# Altium schematic sheet cm4-carrier-net.SchDoc
size 594 x 420 mm
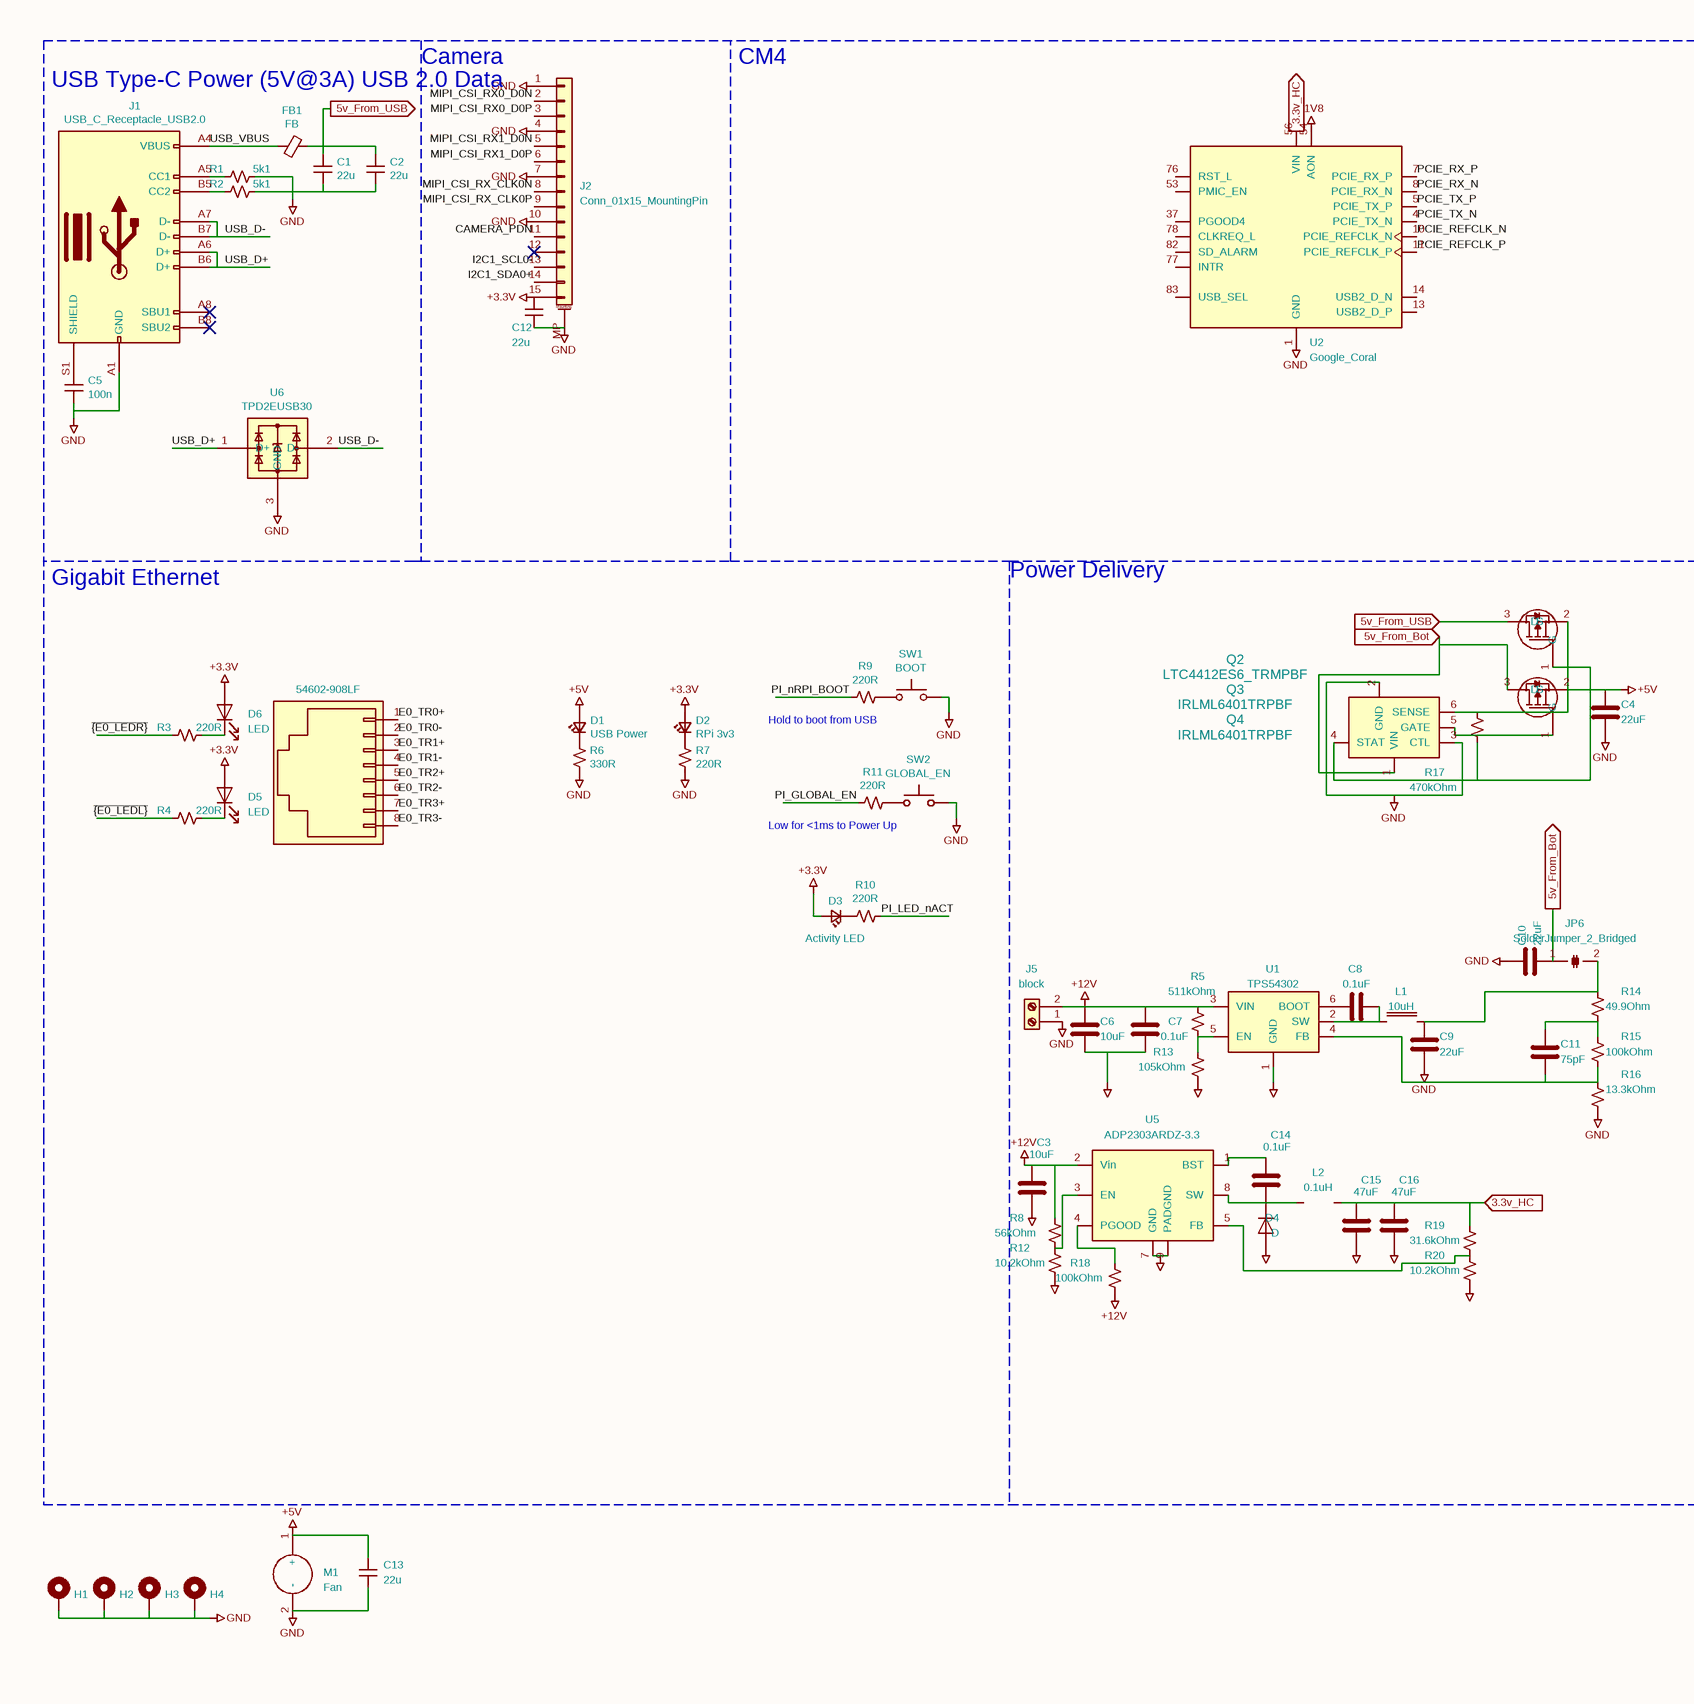
[diagram p0: cm4-carrier-net.SchDoc, left]
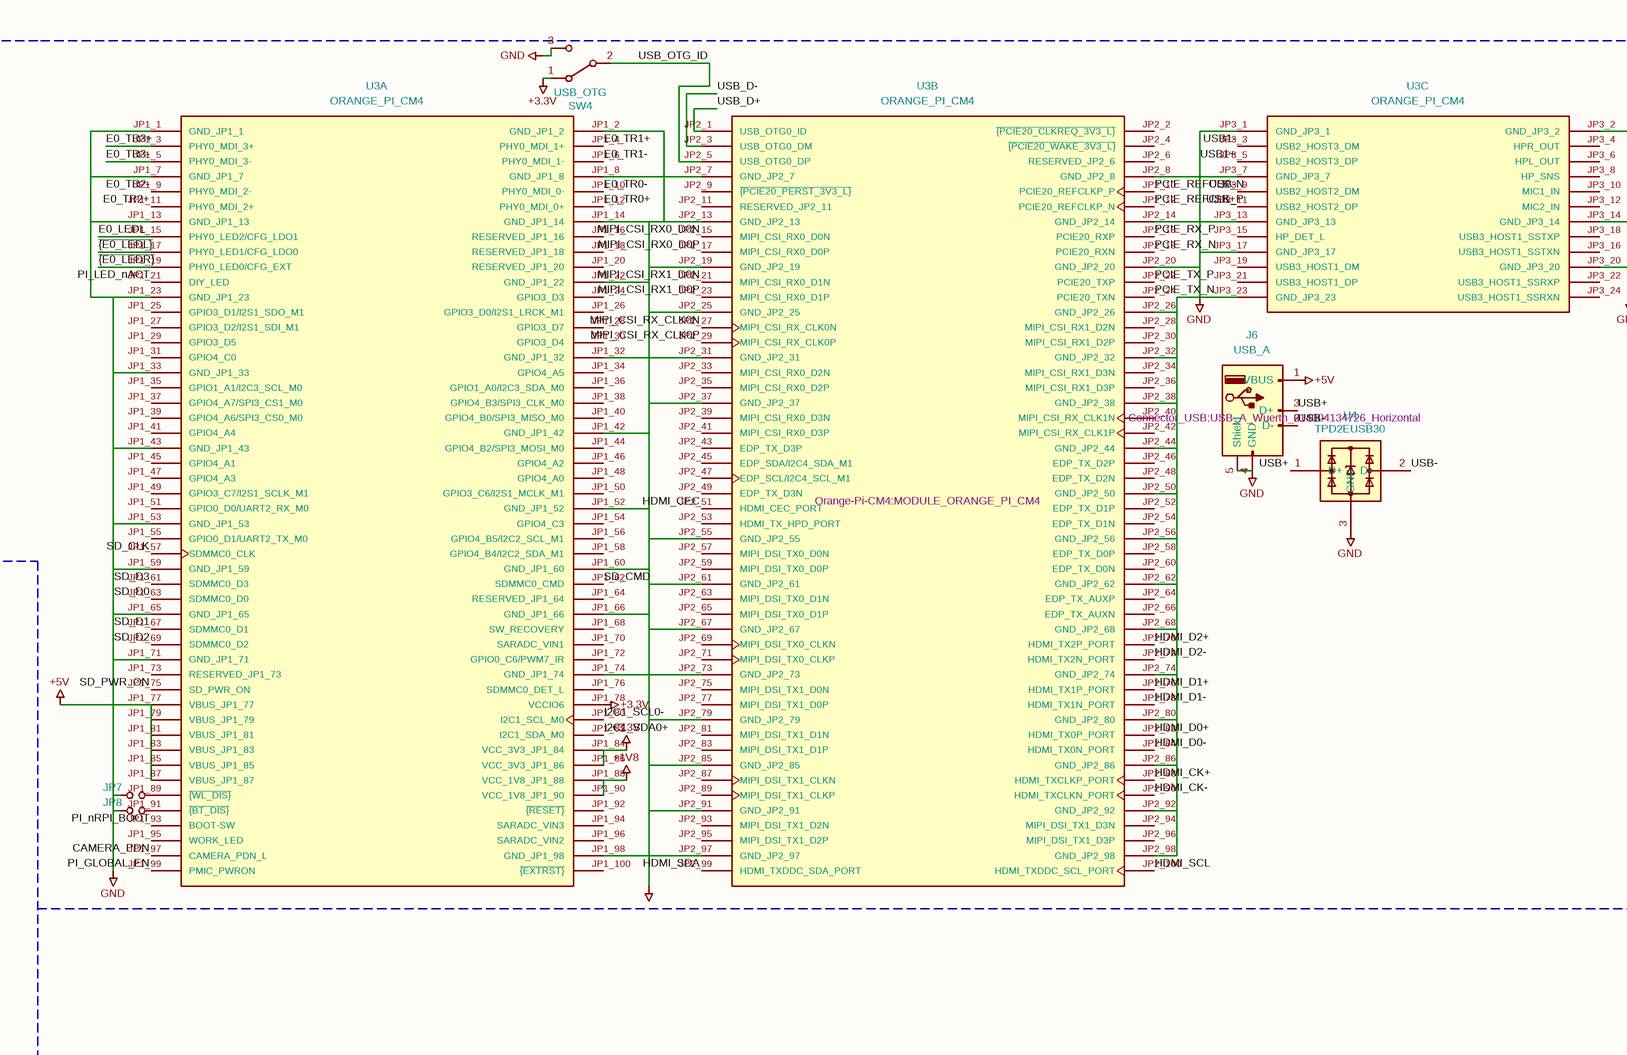
[diagram p1: cm4-carrier-net.SchDoc, middle]
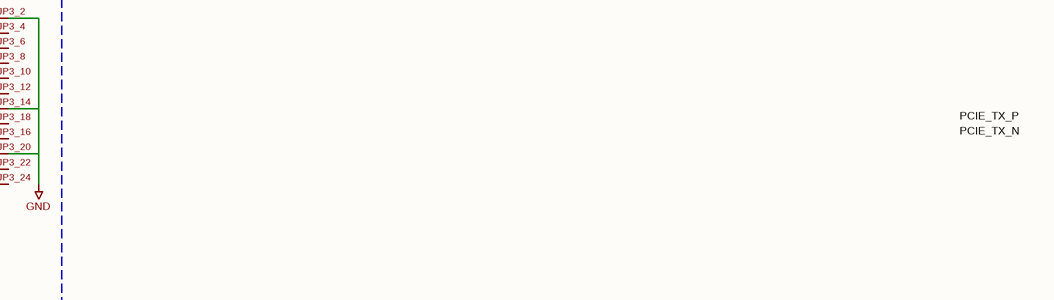
[diagram p2: cm4-carrier-net.SchDoc, right]

## Parts
C1  22u  [C_0805_2012Metric]
C2  22u  [C_0805_2012Metric]
C3  10uF  [C_1206_3216Metric]
C4  22uF  [C_1206_3216Metric]
C5  100n  [C_0805_2012Metric]
C6  10uF  [C_1206_3216Metric]
C7  0.1uF  [C_1206_3216Metric]
C8  0.1uF  [C_1206_3216Metric]
C9  22uF  [C_1206_3216Metric]
C10  22uF  [C_1206_3216Metric]
C11  75pF  [C_1206_3216Metric]
C12  22u  [C_0805_2012Metric]
C13  22u  [C_0805_2012Metric]
C14  0.1uF  [C_1206_3216Metric]
C15  47uF  [C_1206_3216Metric]
C16  47uF  [C_1206_3216Metric]
D1  USB Power  [LED_0603_1608Metric]
D2  RPi 3v3  [LED_0603_1608Metric]
D3  Activity LED  [LED_0603_1608Metric]
D4  D  [D_1206_3216Metric]
D5  LED  [D_1206_3216Metric_Pad1.42x1.75mm_HandSolder]
D6  LED  [D_1206_3216Metric_Pad1.42x1.75mm_HandSolder]
FB1  FB  [L_0805_2012Metric]
H1  MountingHole_Pad  [MountingHole_2.7mm_M2.5_Pad_Via]  (value not drawn)
H2  MountingHole_Pad  [MountingHole_2.7mm_M2.5_Pad_Via]  (value not drawn)
H3  MountingHole_Pad  [MountingHole_2.7mm_M2.5_Pad_Via]  (value not drawn)
H4  MountingHole_Pad  [MountingHole_2.7mm_M2.5_Pad_Via]  (value not drawn)
J1  USB_C_Receptacle_USB2.0  [USB_C_Receptacle_G-Switch_GT-USB-7010ASV]
J2  Conn_01x15_MountingPin  [Molex_200528-0150_1x15-1MP_P1.00mm_Horizontal]
J3  54602-908LF  [Ethernet_Jack_54602-908LF]
J5  block  [TerminalBlock_4Ucon_1x02_P3.50mm_Vertical]
J6  Footprint: Connector_USB:USB_A_Wuerth_614004134726_Horizontal  [USB_A_Wuerth_614004134726_Horizontal]  (hidden comment: USB_A)
JP6  SolderJumper_2_Bridged  [SolderJumper-2_P1.3mm_Bridged2Bar_RoundedPad1.0x1.5mm]
JP7  ~WL_nDisable  [SolderJumper-2_P1.3mm_Bridged2Bar_Pad1.0x1.5mm]  (value not drawn)
JP8  ~BT_nDisable  [SolderJumper-2_P1.3mm_Bridged2Bar_Pad1.0x1.5mm]  (value not drawn)
L1  10uH  [L_6.3x6.3_H3]
L2  0.1uH  [L_6.3x6.3_H3]
M1  Fan  [PinHeader_1x02_P2.54mm_Vertical]
Q2  LTC4412ES6_TRMPBF  [SOT-23-6]
Q3  IRLML6401TRPBF  [SOT-23-3]
Q4  IRLML6401TRPBF  [SOT-23-3]
R1  5k1  [R_0603_1608Metric]
R2  5k1  [R_0603_1608Metric]
R3  220R  [R_0603_1608Metric]
R4  220R  [R_0603_1608Metric]
R5  511kOhm  [R_0603_1608Metric]
R6  330R  [R_0603_1608Metric]
R7  220R  [R_0603_1608Metric]
R8  56kOhm  [R_0603_1608Metric]
R9  220R  [R_0603_1608Metric]
R10  220R  [R_0603_1608Metric]
R11  220R  [R_0603_1608Metric]
R12  10.2kOhm  [R_0603_1608Metric]
R13  105kOhm  [R_0603_1608Metric]
R14  49.9Ohm  [R_0603_1608Metric]
R15  100kOhm  [R_0603_1608Metric]
R16  13.3kOhm  [R_0603_1608Metric]
R17  470kOhm  [R_0603_1608Metric]
R18  100kOhm  [R_0603_1608Metric]
R19  31.6kOhm  [R_0603_1608Metric]
R20  10.2kOhm  [R_0603_1608Metric]
SW1  BOOT  [SW_SPST_B3U-1000P]
SW2  GLOBAL_EN  [SW_SPST_B3U-1000P]
SW4  USB_OTG  [SW_SPDT_CK-JS102011SAQN]
U1  TPS54302  [SOT-23-6]
U2  Google_Coral  [Google_Coral_SMT_TPU_Module]
U3  ORANGE_PI_CM4  [MODULE_ORANGE_PI_CM4]  (parts A,B,C of 3)
U4  TPD2EUSB30  [Texas_DRT-3]
U5  ADP2303ARDZ-3.3  [SOIC-8-1EP_3.9x4.9mm_P1.27mm_EP2.29x3mm]
U6  TPD2EUSB30  [Texas_DRT-3]

## Ports
3.3v_HC (in), 5v_From_Bot (in), 5v_From_Bot (out), 5v_From_USB (in), 5v_From_USB (out)

## Nets
+1V8: U2.54(AON) U3.JP1_88(VCC_1V8_JP1_88) U3.JP1_90(VCC_1V8_JP1_90)
+3.3V: C12.1 D2.2(A) D3.2(A) D5.2(A) D6.2(A) J2.15(Pin_15) SW4.1(A) U3.JP1_78(VCCIO6) U3.JP1_84(VCC_3V3_JP1_84) U3.JP1_86(VCC_3V3_JP1_86)
+5V: C4.1 C13.1 D1.2(A) J6.1(VBUS) M1.1(+) Q2.6(SENSE) Q3.2(S) Q4.2(S) R17.1 U3.JP1_77(VBUS_JP1_77) U3.JP1_79(VBUS_JP1_79) U3.JP1_81(VBUS_JP1_81) U3.JP1_83(VBUS_JP1_83) U3.JP1_85(VBUS_JP1_85) U3.JP1_87(VBUS_JP1_87)
+12V: C3.1 C6.1 C7.1 J5.2(Pin_2) R5.1 R8.1 R18.2 U1.3(VIN) U5.2(Vin)
GND: C1.2 C2.2 C3.2 C4.2 C5.2 C6.2 C7.2 C9.2 C10.1 C12.2 C13.2 C15.2 C16.2 D4.2(A) H1.1 H2.1 H3.1 H4.1 J1.A1(GND) J2.1(Pin_1) J2.4(Pin_4) J2.7(Pin_7) J2.10(Pin_10) J2.MP(MountPin) J5.1(Pin_1) J6.4(GND) J6.5(Shield) JP7.1 JP8.1 M1.2(-) Q2.2(GND) Q2.3(CTL) R1.1 R2.1 R6.2 R7.2 R12.2 R13.2 R16.2 R20.2 SW1.2 SW2.2 SW4.3(C) U1.1(GND) U2.1(GND) U3.JP1_1(GND_JP1_1) U3.JP1_2(GND_JP1_2) U3.JP1_7(GND_JP1_7) U3.JP1_8(GND_JP1_8) U3.JP1_13(GND_JP1_13) U3.JP1_14(GND_JP1_14) U3.JP1_22(GND_JP1_22) U3.JP1_23(GND_JP1_23) U3.JP1_32(GND_JP1_32) U3.JP1_33(GND_JP1_33) U3.JP1_42(GND_JP1_42) U3.JP1_43(GND_JP1_43) U3.JP1_52(GND_JP1_52) U3.JP1_53(GND_JP1_53) U3.JP1_59(GND_JP1_59) U3.JP1_60(GND_JP1_60) U3.JP1_65(GND_JP1_65) U3.JP1_66(GND_JP1_66) U3.JP1_71(GND_JP1_71) U3.JP1_74(GND_JP1_74) U3.JP1_98(GND_JP1_98) U3.JP2_7(GND_JP2_7) U3.JP2_8(GND_JP2_8) U3.JP2_13(GND_JP2_13) U3.JP2_14(GND_JP2_14) U3.JP2_19(GND_JP2_19) U3.JP2_20(GND_JP2_20) U3.JP2_25(GND_JP2_25) U3.JP2_26(GND_JP2_26) U3.JP2_31(GND_JP2_31) U3.JP2_32(GND_JP2_32) U3.JP2_37(GND_JP2_37) U3.JP2_38(GND_JP2_38) U3.JP2_44(GND_JP2_44) U3.JP2_50(GND_JP2_50) U3.JP2_55(GND_JP2_55) U3.JP2_56(GND_JP2_56) U3.JP2_61(GND_JP2_61) U3.JP2_62(GND_JP2_62) U3.JP2_67(GND_JP2_67) U3.JP2_68(GND_JP2_68) U3.JP2_73(GND_JP2_73) U3.JP2_74(GND_JP2_74) U3.JP2_79(GND_JP2_79) U3.JP2_80(GND_JP2_80) U3.JP2_85(GND_JP2_85) U3.JP2_86(GND_JP2_86) U3.JP2_91(GND_JP2_91) U3.JP2_92(GND_JP2_92) U3.JP2_97(GND_JP2_97) U3.JP2_98(GND_JP2_98) U3.JP3_1(GND_JP3_1) U3.JP3_2(GND_JP3_2) U3.JP3_7(GND_JP3_7) U3.JP3_13(GND_JP3_13) U3.JP3_14(GND_JP3_14) U3.JP3_17(GND_JP3_17) U3.JP3_20(GND_JP3_20) U3.JP3_23(GND_JP3_23) U4.3(GND) U5.7(GND) U5.9(PADGND) U6.3(GND)
3.3v_HC: C15.1 C16.1 L2.2 R19.1 U2.56(VIN) ; port 3.3v_HC
5v_From_Bot: C10.2 JP6.1(A) Q2.1(VIN) Q3.3(D) ; port 5v_From_Bot
5v_From_USB: C1.1 C2.1 FB1.1 Q4.3(D) ; port 5v_From_USB
CAMERA_PDN: J2.11(Pin_11) U3.JP1_97(CAMERA_PDN_L)
E0_LEDL: U3.JP1_15(PHY0_LED2/CFG_LDO1)
E0_TR0+: J3.1 U3.JP1_12(PHY0_MDI_0+)
E0_TR0-: J3.2 U3.JP1_10(PHY0_MDI_0-)
E0_TR1+: J3.3 U3.JP1_4(PHY0_MDI_1+)
E0_TR1-: J3.4 U3.JP1_6(PHY0_MDI_1-)
E0_TR2+: J3.5 U3.JP1_11(PHY0_MDI_2+)
E0_TR2-: J3.6 U3.JP1_9(PHY0_MDI_2-)
E0_TR3+: J3.7 U3.JP1_3(PHY0_MDI_3+)
E0_TR3-: J3.8 U3.JP1_5(PHY0_MDI_3-)
HDMI_CEC: U3.JP2_51(HDMI_CEC_PORT)
HDMI_CK+: U3.JP2_88(HDMI_TXCLKP_PORT)
HDMI_CK-: U3.JP2_90(HDMI_TXCLKN_PORT)
HDMI_D0+: U3.JP2_82(HDMI_TX0P_PORT)
HDMI_D0-: U3.JP2_84(HDMI_TX0N_PORT)
HDMI_D1+: U3.JP2_76(HDMI_TX1P_PORT)
HDMI_D1-: U3.JP2_78(HDMI_TX1N_PORT)
HDMI_D2+: U3.JP2_70(HDMI_TX2P_PORT)
HDMI_D2-: U3.JP2_72(HDMI_TX2N_PORT)
HDMI_SCL: U3.JP2_100(HDMI_TXDDC_SCL_PORT)
HDMI_SDA: U3.JP2_99(HDMI_TXDDC_SDA_PORT)
I2C1_SCL0-: J2.13(Pin_13) U3.JP1_80(I2C1_SCL_M0)
I2C1_SDA0+: J2.14(Pin_14) U3.JP1_82(I2C1_SDA_M0)
MIPI_CSI_RX0_D0N: J2.2(Pin_2) U3.JP2_15(MIPI_CSI_RX0_D0N)
MIPI_CSI_RX0_D0P: J2.3(Pin_3) U3.JP2_17(MIPI_CSI_RX0_D0P)
MIPI_CSI_RX1_D0N: J2.5(Pin_5) U3.JP2_21(MIPI_CSI_RX0_D1N)
MIPI_CSI_RX1_D0P: J2.6(Pin_6) U3.JP2_23(MIPI_CSI_RX0_D1P)
MIPI_CSI_RX_CLK0N: J2.8(Pin_8) U3.JP2_27(MIPI_CSI_RX_CLK0N)
MIPI_CSI_RX_CLK0P: J2.9(Pin_9) U3.JP2_29(MIPI_CSI_RX_CLK0P)
PCIE_REFCLK_N: U2.10(PCIE_REFCLK_N) U3.JP2_10(PCIE20_REFCLKP_P)
PCIE_REFCLK_P: U2.11(PCIE_REFCLK_P) U3.JP2_12(PCIE20_REFCLKP_N)
PCIE_RX_N: U2.8(PCIE_RX_N) U3.JP2_18(PCIE20_RXN)
PCIE_RX_P: U2.7(PCIE_RX_P) U3.JP2_16(PCIE20_RXP)
PCIE_TX_N: U2.4(PCIE_TX_N) U3.JP2_24(PCIE20_TXN)
PCIE_TX_P: U2.5(PCIE_TX_P) U3.JP2_22(PCIE20_TXP)
PI_GLOBAL_EN: R11.2 U3.JP1_99(PMIC_PWRON)
PI_LED_nACT: R10.1 U3.JP1_21(DIY_LED)
PI_nRPI_BOOT: R9.2 U3.JP1_93(BOOT-SW)
SD_CLK: U3.JP1_57(SDMMC0_CLK)
SD_CMD: U3.JP1_62(SDMMC0_CMD)
SD_D0: U3.JP1_63(SDMMC0_D0)
SD_D1: U3.JP1_67(SDMMC0_D1)
SD_D2: U3.JP1_69(SDMMC0_D2)
SD_D3: U3.JP1_61(SDMMC0_D3)
SD_PWR_ON: U3.JP1_75(SD_PWR_ON)
USB1+: U3.JP3_5(USB2_HOST3_DP)
USB1-: U3.JP3_3(USB2_HOST3_DM)
USB+: J6.3(D+) U3.JP3_11(USB2_HOST2_DP) U4.1(D+)
USB-: J6.2(D-) U3.JP3_9(USB2_HOST2_DM) U4.2(D-)
USB_D+: J1.A6(D+) J1.B6(D+) U3.JP2_1(USB_OTG0_ID) U6.1(D+)
USB_D-: J1.A7(D-) J1.B7(D-) U3.JP2_3(USB_OTG0_DM) U6.2(D-)
USB_OTG_ID: SW4.2(B) U3.JP2_5(USB_OTG0_DP)
USB_VBUS: FB1.2 J1.A4(VBUS)
~{{E0_LEDL}}: R4.2 U3.JP1_17(PHY0_LED1/CFG_LDO0)
~{{E0_LEDR}}: R3.2 U3.JP1_19(PHY0_LED0/CFG_EXT)
NetC5_1: C5.1 J1.S1(SHIELD)
NetC8_1: C8.1 U1.6(BOOT)
NetC8_2: C8.2 L1.1 U1.2(SW)
NetC9_1: C9.1 JP6.2(B) L1.2 R14.1
NetC11_1: C11.1 R14.2 R15.1
NetC11_2: C11.2 R15.2 R16.1 U1.4(FB)
NetC14_1: C14.1 U5.1(BST)
NetC14_2: C14.2 D4.1(K) L2.1 U5.8(SW)
NetD1_1: D1.1(K) R6.1
NetD2_1: D2.1(K) R7.1
NetD3_1: D3.1(K) R10.2
NetD5_1: D5.1(K) R4.1
NetD6_1: D6.1(K) R3.1
NetJ1_A5: J1.A5(CC1) R1.2
NetJ1_B5: J1.B5(CC2) R2.2
NetJP7_2: JP7.2 U3.JP1_89(~{{WL_DIS}})
NetJP8_2: JP8.2 U3.JP1_91(~{{BT_DIS}})
NetQ2_4: Q2.4(STAT) Q4.1(G) R17.2
NetQ2_5: Q2.5(GATE) Q3.1(G)
NetR5_2: R5.2 R13.1 U1.5(EN)
NetR8_2: R8.2 R12.1 U5.3(EN)
NetR9_1: R9.1 SW1.1
NetR11_1: R11.1 SW2.1
NetR18_1: R18.1 U5.4(PGOOD)
NetR19_2: R19.2 R20.1 U5.5(FB)

Not connected (* = marked no-connect by the designer): J1 A8(SBU1)* A9(VBUS) A12(GND) B1(GND) B4(VBUS) B8(SBU2)* B9(VBUS) B12(GND); J2 12(Pin_12)*; U2 2(GND) 3(GND) 6(GND) 9(GND) 12(GND) 13(USB2_D_P) 14(USB2_D_N) 15(GND) 16(GND) 17(GND) 18(GND) 19(GND) 20(GND) 21(GND) 22(GND) 23(GND) 24(GND) 25(GND) 26(GND) 27(GND) 28(GND) 29(GND) 30(GND) 31(GND) 32(GND) 33(GND) 34(GND) 35(GND) 36(GND) 37(PGOOD4) 38(GND) 39(GND) 40(GND) 41(GND) 42(GND) 43(GND) 44(GND) 45(GND) 46(GND) 47(GND) 48(GND) 49(RESERVED) 50(RESERVED) 51(GND) 52(RESERVED) 53(PMIC_EN) 55(GND) 57(VIN) 58(VIN) 59(VIN) 60(VIN) 61(VIN) 62(VIN) 63(VIN) 64(VIN) 65(VIN) 66(VIN) 67(VIN) 68(GND) 69(GND) 70(GND) 71(GND) 72(GND) 73(GND) 74(GND) 75(GND) 76(RST_L) 77(INTR) 78(CLKREQ_L) 79(GND) 80(GND) 81(GND) 82(SD_ALARM) 83(USB_SEL) 84(RESERVED) 85(RESERVED) 86(GND) 87(GND) 88(GND) 89(GND) 90(GND) 91(GND) 92(GND) 93(GND) 94(GND) 95(GND) 96(GND) 97(GND) 98(GND) 99(GND) 100(GND) 101(GND) 102(GND) 103(GND) 104(GND) 105(GND) 106(GND) 107(GND) 108(GND) 109(GND) 110(GND) 111(GND) 112(GND) 113(GND) 114(GND) 115(GND) 116(GND) 117(GND) 118(GND) 119(GND) 120(GND); U3 JP1_16(RESERVED_JP1_16) JP1_18(RESERVED_JP1_18) JP1_20(RESERVED_JP1_20) JP1_24(GPIO3_D3) JP1_25(GPIO3_D1/I2S1_SDO_M1) JP1_26(GPIO3_D0/I2S1_LRCK_M1) JP1_27(GPIO3_D2/I2S1_SDI_M1) JP1_28(GPIO3_D7) JP1_29(GPIO3_D5) JP1_30(GPIO3_D4) JP1_31(GPIO4_C0) JP1_34(GPIO4_A5) JP1_35(GPIO1_A1/I2C3_SCL_M0) JP1_36(GPIO1_A0/I2C3_SDA_M0) JP1_37(GPIO4_A7/SPI3_CS1_M0) JP1_38(GPIO4_B3/SPI3_CLK_M0) JP1_39(GPIO4_A6/SPI3_CS0_M0) JP1_40(GPIO4_B0/SPI3_MISO_M0) JP1_41(GPIO4_A4) JP1_44(GPIO4_B2/SPI3_MOSI_M0) JP1_45(GPIO4_A1) JP1_46(GPIO4_A2) JP1_47(GPIO4_A3) JP1_48(GPIO4_A0) JP1_49(GPIO3_C7/I2S1_SCLK_M1) JP1_50(GPIO3_C6/I2S1_MCLK_M1) JP1_51(GPIO0_D0/UART2_RX_M0) JP1_54(GPIO4_C3) JP1_55(GPIO0_D1/UART2_TX_M0) JP1_56(GPIO4_B5/I2C2_SCL_M1) JP1_58(GPIO4_B4/I2C2_SDA_M1) JP1_64(RESERVED_JP1_64) JP1_68(SW_RECOVERY) JP1_70(SARADC_VIN1) JP1_72(GPIO0_C6/PWM7_IR) JP1_73(RESERVED_JP1_73) JP1_76(SDMMC0_DET_L) JP1_92(~{{RESET}}) JP1_94(SARADC_VIN3) JP1_95(WORK_LED) JP1_96(SARADC_VIN2) JP1_100(~{{EXTRST}}) JP2_2(~{{PCIE20_CLKREQ_3V3_L}}) JP2_4(~{{PCIE20_WAKE_3V3_L}}) JP2_6(RESERVED_JP2_6) JP2_9(~{{PCIE20_PERST_3V3_L}}) JP2_11(RESERVED_JP2_11) JP2_28(MIPI_CSI_RX1_D2N) JP2_30(MIPI_CSI_RX1_D2P) JP2_33(MIPI_CSI_RX0_D2N) JP2_34(MIPI_CSI_RX1_D3N) JP2_35(MIPI_CSI_RX0_D2P) JP2_36(MIPI_CSI_RX1_D3P) JP2_39(MIPI_CSI_RX0_D3N) JP2_40(MIPI_CSI_RX_CLK1N) JP2_41(MIPI_CSI_RX0_D3P) JP2_42(MIPI_CSI_RX_CLK1P) JP2_43(EDP_TX_D3P) JP2_45(EDP_SDA/I2C4_SDA_M1) JP2_46(EDP_TX_D2P) JP2_47(EDP_SCL/I2C4_SCL_M1) JP2_48(EDP_TX_D2N) JP2_49(EDP_TX_D3N) JP2_52(EDP_TX_D1P) JP2_53(HDMI_TX_HPD_PORT) JP2_54(EDP_TX_D1N) JP2_57(MIPI_DSI_TX0_D0N) JP2_58(EDP_TX_D0P) JP2_59(MIPI_DSI_TX0_D0P) JP2_60(EDP_TX_D0N) JP2_63(MIPI_DSI_TX0_D1N) JP2_64(EDP_TX_AUXP) JP2_65(MIPI_DSI_TX0_D1P) JP2_66(EDP_TX_AUXN) JP2_69(MIPI_DSI_TX0_CLKN) JP2_71(MIPI_DSI_TX0_CLKP) JP2_75(MIPI_DSI_TX1_D0N) JP2_77(MIPI_DSI_TX1_D0P) JP2_81(MIPI_DSI_TX1_D1N) JP2_83(MIPI_DSI_TX1_D1P) JP2_87(MIPI_DSI_TX1_CLKN) JP2_89(MIPI_DSI_TX1_CLKP) JP2_93(MIPI_DSI_TX1_D2N) JP2_94(MIPI_DSI_TX1_D3N) JP2_95(MIPI_DSI_TX1_D2P) JP2_96(MIPI_DSI_TX1_D3P) JP3_4(HPR_OUT) JP3_6(HPL_OUT) JP3_8(HP_SNS) JP3_10(MIC1_IN) JP3_12(MIC2_IN) JP3_15(HP_DET_L) JP3_16(USB3_HOST1_SSTXN) JP3_18(USB3_HOST1_SSTXP) JP3_19(USB3_HOST1_DM) JP3_21(USB3_HOST1_DP) JP3_22(USB3_HOST1_SSRXP) JP3_24(USB3_HOST1_SSRXN); U5 6(NC)

## Notes on the sheet
- Camera
- CM4
- USB Type-C Power (5V@3A)
  USB 2.0 Data
- Gigabit Ethernet
- Power Delivery
- Hold to boot from USB
- Low for <1ms to Power Up
- Labels drawn without touching a wire or pin: PCIE_TX_N, PCIE_TX_P
- 1
- 2
- 3
- 4
- 5
- 6
- 7
- 8
- 9
- 10
- 11
- A
- B
- C
- D
- E
- F
- G
- H
- twitch.tv/jkiv <http://twitch.tv/jkiv>
- Title: cm4-carrier-net
- File: cm4-carrier-net.kicad_sch
- Sheet: /
- fourside.io <http://fourside.io>
- KiCad E.D.A.  kicad (5.1.4)-1
- Size: A2
- Date: 2021-09-17
- Rev: v1.0a
- Id: 1/1
- (in symbol Conn_01x15_MountingPin) Mounting

## Library data of the parts
C1 C2 C5 C12 C13 = C_Small: Footprint: Capacitor_SMD:C_0805_2012Metric
  C1 C2 C12 C13: Value: 22u
  C5: Value: 100n
C3 C4 C6-C11 C14-C16 = C: Footprint: Capacitor_SMD:C_1206_3216Metric
  C3 C6: Value: 10uF
  C4 C9 C10: Value: 22uF
  C7 C8 C14: Value: 0.1uF
  C11: Value: 75pF
  C15 C16: Value: 47uF
D1-D3 = LED_Small: Footprint: LED_SMD:LED_0603_1608Metric
  D1: Value: USB Power
  D2: Value: RPi 3v3
  D3: Value: Activity LED
D4 = D: Description: Diode; Sim.Pins: 1=K 2=A; Sim.Device: D; Value: D; Footprint: Diode_SMD:D_1206_3216Metric
FB1 = Ferrite_Bead_Small-Device: Value: FB; Footprint: Inductor_SMD:L_0805_2012Metric
J3 = 54602-908LF: Manufacturer: Amphenol ICC (FCI); Description: CONN MOD JACK 8P8C R/A UNSHLD; DK_Detail_Page: /product-detail/en/amphenol-icc-fci/54602-908LF/609-1046-ND/1001360; Digi-Key_PN: 609-1046-ND; MPN: 54602-908LF; Category: Connectors, Interconnects; Family: Modular Connectors - Jacks; Status: Active; Value: 54602-908LF; Footprint: digikey-footprints:Ethernet_Jack_54602-908LF
J5 = Screw_Terminal_01x02: Value: block; Footprint: TerminalBlock_4Ucon:TerminalBlock_4Ucon_1x02_P3.50mm_Vertical
JP7 JP8 = Jumper_NC_Small-Device: Footprint: Jumper:SolderJumper-2_P1.3mm_Bridged2Bar_Pad1.0x1.5mm
  JP7: Value: ~WL_nDisable
  JP8: Value: ~BT_nDisable
L1 = L_Iron: Value: 10uH; Footprint: Inductor_SMD:L_6.3x6.3_H3
L2 = L: Description: Inductor; Value: 0.1uH; Footprint: Inductor_SMD:L_6.3x6.3_H3
Q2 = LTC4412ES6_TRMPBF: MPN: LTC4412ES6#TRMPBF; Manufacturer: Linear Technology/Analog Devices; Description: IC OR CTRLR SRC SELECT TSOT23-6; DK_Detail_Page: /product-detail/en/linear-technology-analog-devices/LTC4412ES6-TRMPBF/LTC4412ES6-TRMPBFCT-ND/890097; Digi-Key_PN: LTC4412ES6#TRMPBFCT-ND; Category: Integrated Circuits (ICs); Family: PMIC - OR Controllers, Ideal Diodes; DK_Datasheet_Link: http://www.linear.com/docs/1527; Status: Active; Value: LTC4412ES6_TRMPBF; Footprint: digikey-footprints:SOT-23-6
Q3 Q4 = IRLML6401TRPBF: Manufacturer: Infineon Technologies; Description: MOSFET P-CH 12V 4.3A SOT-23; DK_Detail_Page: /product-detail/en/infineon-technologies/IRLML6401TRPBF/IRLML6401PBFCT-ND/812509; Digi-Key_PN: IRLML6401PBFCT-ND; MPN: IRLML6401TRPBF; Category: Discrete Semiconductor Products; Family: Transistors - FETs, MOSFETs - Single; DK_Datasheet_Link: https://www.infineon.com/dgdl/irlml6401pbf.pdf?fileId=5546d462533600a401535668b96d2634; Status: Active; Value: IRLML6401TRPBF; Footprint: digikey-footprints:SOT-23-3
R1-R20 = R_Small_US: Footprint: Resistor_SMD:R_0603_1608Metric
  R1 R2: Value: 5k1
  R3 R4 R7 R9-R11: Value: 220R
  R5: Value: 511kOhm
  R6: Value: 330R
  R8: Value: 56kOhm
  R12 R20: Value: 10.2kOhm
  R13: Value: 105kOhm
  R14: Value: 49.9Ohm
  R15 R18: Value: 100kOhm
  R16: Value: 13.3kOhm
  R17: Value: 470kOhm
  R19: Value: 31.6kOhm
SW1 SW2 = SW_Push: Footprint: Button_Switch_SMD:SW_SPST_B3U-1000P
  SW1: Value: BOOT
  SW2: Value: GLOBAL_EN
SW4 = SW_SPDT: Value: USB_OTG; Footprint: Button_Switch_SMD:SW_SPDT_CK-JS102011SAQN
U2 = Google_Coral: Description: Edge TPU, 4 TOPS, 2W, 120-LGA; Value: Google_Coral; Footprint: TPU:Google_Coral_SMT_TPU_Module
U3 = ORANGE_PI_CM4: Description: \nOrange Pi Compute Module 4\n; MF: Orange Pi; MP: Orange Pi CM4; MAXIMUM_PACKAGE_HEIGHT: 5.1mm; Package: Custom_CM4 Orange Pi; Price: None; Check_prices: https://www.snapeda.com/parts/Orange%20Pi%20CM4/Orange+Pi/view-part/?ref=eda; STANDARD: Manufacturer Recommendations; PARTREV: v1.2; SnapEDA_Link: https://www.snapeda.com/parts/Orange%20Pi%20CM4/Orange+Pi/view-part/?ref=snap; Availability: Not in stock; MANUFACTURER: Orange Pi; Value: ORANGE_PI_CM4; Footprint: Orange-Pi-CM4:MODULE_ORANGE_PI_CM4
U5 = ADP2303ARDZ-3.3: Description: Nonsynchronous Step-Down Regulator 3 Amp Vout 3.3v SOIC-8; Value: ADP2303ARDZ-3.3; Footprint: Package_SO:SOIC-8-1EP_3.9x4.9mm_P1.27mm_EP2.29x3mm
D5 D6 = LED: Value: LED; Footprint: Diode_SMD:D_1206_3216Metric_Pad1.42x1.75mm_HandSolder
H1-H4 = MountingHole_Pad: Value: MountingHole_Pad; Footprint: MountingHole:MountingHole_2.7mm_M2.5_Pad_Via
J1 = USB_C_Receptacle_USB2.0: Value: USB_C_Receptacle_USB2.0; Footprint: Connector_USB:USB_C_Receptacle_G-Switch_GT-USB-7010ASV
J2 = Conn_01x15_MountingPin: Value: Conn_01x15_MountingPin; Footprint: Connector_FFC-FPC:Molex_200528-0150_1x15-1MP_P1.00mm_Horizontal
J6 = USB_A: Value: USB_A
JP6 = SolderJumper_2_Bridged: Value: SolderJumper_2_Bridged; Footprint: Jumper:SolderJumper-2_P1.3mm_Bridged2Bar_RoundedPad1.0x1.5mm
M1 = Fan: Value: Fan; Footprint: Connector_PinHeader_2.54mm:PinHeader_1x02_P2.54mm_Vertical
U1 = TPS54302: Value: TPS54302; Footprint: Package_TO_SOT_SMD:SOT-23-6
U4 U6 = TPD2EUSB30: Value: TPD2EUSB30; Footprint: Package_TO_SOT_SMD:Texas_DRT-3